# EAGLE design ODU Display 0603 (EAGLE 9.6.2)
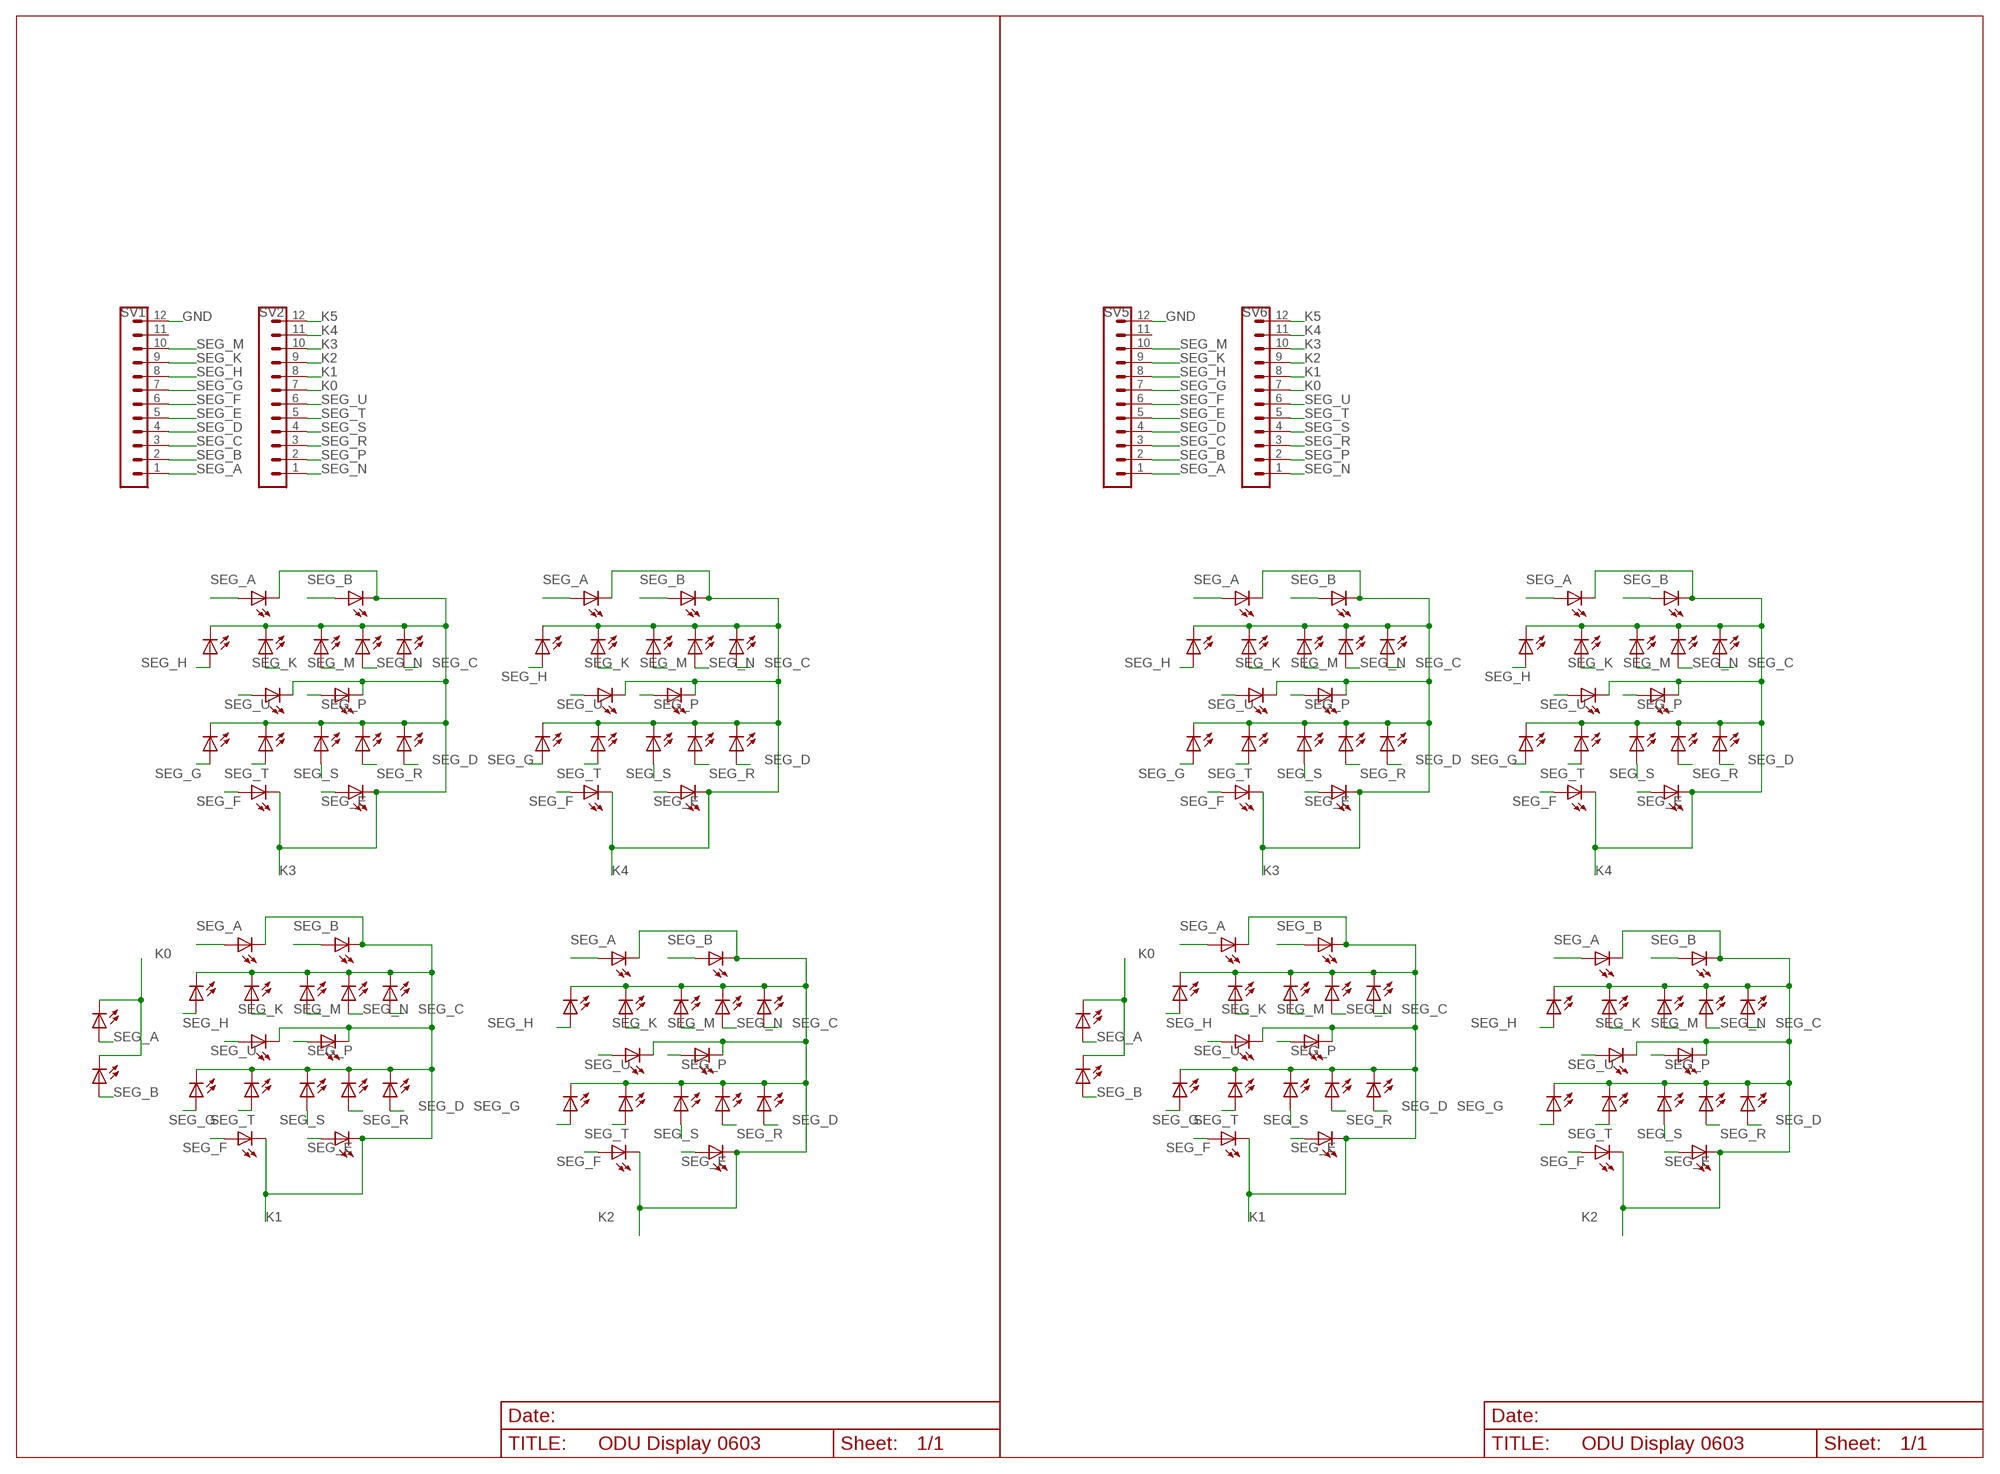
[diagram p0: schematic, sheet 1]

## Parts
LED_A1  LEDSMT0603_1  [CHIPLED_0603]
LED_A2  LEDSMT0603_1  [CHIPLED_0603]
LED_A3  LEDSMT0603_1  [CHIPLED_0603]
LED_A4  LEDSMT0603_1  [CHIPLED_0603]
LED_A9  LEDSMT0603_1  [CHIPLED_0603]
LED_A10  LEDSMT0603_1  [CHIPLED_0603]
LED_A11  LEDSMT0603_1  [CHIPLED_0603]
LED_A12  LEDSMT0603_1  [CHIPLED_0603]
LED_B1  LEDSMT0603_1  [CHIPLED_0603]
LED_B2  LEDSMT0603_1  [CHIPLED_0603]
LED_B3  LEDSMT0603_1  [CHIPLED_0603]
LED_B4  LEDSMT0603_1  [CHIPLED_0603]
LED_B9  LEDSMT0603_1  [CHIPLED_0603]
LED_B10  LEDSMT0603_1  [CHIPLED_0603]
LED_B11  LEDSMT0603_1  [CHIPLED_0603]
LED_B12  LEDSMT0603_1  [CHIPLED_0603]
LED_C1  LEDSMT0603_1  [CHIPLED_0603]
LED_C2  LEDSMT0603_1  [CHIPLED_0603]
LED_C3  LEDSMT0603_1  [CHIPLED_0603]
LED_C4  LEDSMT0603_1  [CHIPLED_0603]
LED_C9  LEDSMT0603_1  [CHIPLED_0603]
LED_C10  LEDSMT0603_1  [CHIPLED_0603]
LED_C11  LEDSMT0603_1  [CHIPLED_0603]
LED_C12  LEDSMT0603_1  [CHIPLED_0603]
LED_D1  LEDSMT0603_1  [CHIPLED_0603]
LED_D2  LEDSMT0603_1  [CHIPLED_0603]
LED_D3  LEDSMT0603_1  [CHIPLED_0603]
LED_D4  LEDSMT0603_1  [CHIPLED_0603]
LED_D9  LEDSMT0603_1  [CHIPLED_0603]
LED_D10  LEDSMT0603_1  [CHIPLED_0603]
LED_D11  LEDSMT0603_1  [CHIPLED_0603]
LED_D12  LEDSMT0603_1  [CHIPLED_0603]
LED_E1  LEDSMT0603_1  [CHIPLED_0603]
LED_E2  LEDSMT0603_1  [CHIPLED_0603]
LED_E3  LEDSMT0603_1  [CHIPLED_0603]
LED_E4  LEDSMT0603_1  [CHIPLED_0603]
LED_E9  LEDSMT0603_1  [CHIPLED_0603]
LED_E10  LEDSMT0603_1  [CHIPLED_0603]
LED_E11  LEDSMT0603_1  [CHIPLED_0603]
LED_E12  LEDSMT0603_1  [CHIPLED_0603]
LED_F1  LEDSMT0603_1  [CHIPLED_0603]
LED_F2  LEDSMT0603_1  [CHIPLED_0603]
LED_F3  LEDSMT0603_1  [CHIPLED_0603]
LED_F4  LEDSMT0603_1  [CHIPLED_0603]
LED_F9  LEDSMT0603_1  [CHIPLED_0603]
LED_F10  LEDSMT0603_1  [CHIPLED_0603]
LED_F11  LEDSMT0603_1  [CHIPLED_0603]
LED_F12  LEDSMT0603_1  [CHIPLED_0603]
LED_G1  LEDSMT0603_1  [CHIPLED_0603]
LED_G2  LEDSMT0603_1  [CHIPLED_0603]
LED_G3  LEDSMT0603_1  [CHIPLED_0603]
LED_G4  LEDSMT0603_1  [CHIPLED_0603]
LED_G9  LEDSMT0603_1  [CHIPLED_0603]
LED_G10  LEDSMT0603_1  [CHIPLED_0603]
LED_G11  LEDSMT0603_1  [CHIPLED_0603]
LED_G12  LEDSMT0603_1  [CHIPLED_0603]
LED_H1  LEDSMT0603_1  [CHIPLED_0603]
LED_H2  LEDSMT0603_1  [CHIPLED_0603]
LED_H3  LEDSMT0603_1  [CHIPLED_0603]
LED_H4  LEDSMT0603_1  [CHIPLED_0603]
LED_H9  LEDSMT0603_1  [CHIPLED_0603]
LED_H10  LEDSMT0603_1  [CHIPLED_0603]
LED_H11  LEDSMT0603_1  [CHIPLED_0603]
LED_H12  LEDSMT0603_1  [CHIPLED_0603]
LED_K1  LEDSMT0603_1  [CHIPLED_0603]
LED_K2  LEDSMT0603_1  [CHIPLED_0603]
LED_K3  LEDSMT0603_1  [CHIPLED_0603]
LED_K4  LEDSMT0603_1  [CHIPLED_0603]
LED_K9  LEDSMT0603_1  [CHIPLED_0603]
LED_K10  LEDSMT0603_1  [CHIPLED_0603]
LED_K11  LEDSMT0603_1  [CHIPLED_0603]
LED_K12  LEDSMT0603_1  [CHIPLED_0603]
LED_M1  LEDSMT0603_1  [CHIPLED_0603]
LED_M2  LEDSMT0603_1  [CHIPLED_0603]
LED_M3  LEDSMT0603_1  [CHIPLED_0603]
LED_M4  LEDSMT0603_1  [CHIPLED_0603]
LED_M9  LEDSMT0603_1  [CHIPLED_0603]
LED_M10  LEDSMT0603_1  [CHIPLED_0603]
LED_M11  LEDSMT0603_1  [CHIPLED_0603]
LED_M12  LEDSMT0603_1  [CHIPLED_0603]
LED_N1  LEDSMT0603_1  [CHIPLED_0603]
LED_N2  LEDSMT0603_1  [CHIPLED_0603]
LED_N3  LEDSMT0603_1  [CHIPLED_0603]
LED_N4  LEDSMT0603_1  [CHIPLED_0603]
LED_N9  LEDSMT0603_1  [CHIPLED_0603]
LED_N10  LEDSMT0603_1  [CHIPLED_0603]
LED_N11  LEDSMT0603_1  [CHIPLED_0603]
LED_N12  LEDSMT0603_1  [CHIPLED_0603]
LED_P1  LEDSMT0603_1  [CHIPLED_0603]
LED_P2  LEDSMT0603_1  [CHIPLED_0603]
LED_P3  LEDSMT0603_1  [CHIPLED_0603]
LED_P4  LEDSMT0603_1  [CHIPLED_0603]
LED_P9  LEDSMT0603_1  [CHIPLED_0603]
LED_P10  LEDSMT0603_1  [CHIPLED_0603]
LED_P11  LEDSMT0603_1  [CHIPLED_0603]
LED_P12  LEDSMT0603_1  [CHIPLED_0603]
LED_R1  LEDSMT0603_1  [CHIPLED_0603]
LED_R2  LEDSMT0603_1  [CHIPLED_0603]
LED_R3  LEDSMT0603_1  [CHIPLED_0603]
LED_R4  LEDSMT0603_1  [CHIPLED_0603]
LED_R9  LEDSMT0603_1  [CHIPLED_0603]
LED_R10  LEDSMT0603_1  [CHIPLED_0603]
LED_R11  LEDSMT0603_1  [CHIPLED_0603]
LED_R12  LEDSMT0603_1  [CHIPLED_0603]
LED_S1  LEDSMT0603_1  [CHIPLED_0603]
LED_S2  LEDSMT0603_1  [CHIPLED_0603]
LED_S3  LEDSMT0603_1  [CHIPLED_0603]
LED_S4  LEDSMT0603_1  [CHIPLED_0603]
LED_S9  LEDSMT0603_1  [CHIPLED_0603]
LED_S10  LEDSMT0603_1  [CHIPLED_0603]
LED_S11  LEDSMT0603_1  [CHIPLED_0603]
LED_S12  LEDSMT0603_1  [CHIPLED_0603]
LED_SEL1  LEDSMT0603_1  [CHIPLED_0603]
LED_SEL2  LEDSMT0603_1  [CHIPLED_0603]
LED_SEL5  LEDSMT0603_1  [CHIPLED_0603]
LED_SEL6  LEDSMT0603_1  [CHIPLED_0603]
LED_T1  LEDSMT0603_1  [CHIPLED_0603]
LED_T2  LEDSMT0603_1  [CHIPLED_0603]
LED_T3  LEDSMT0603_1  [CHIPLED_0603]
LED_T4  LEDSMT0603_1  [CHIPLED_0603]
LED_T9  LEDSMT0603_1  [CHIPLED_0603]
LED_T10  LEDSMT0603_1  [CHIPLED_0603]
LED_T11  LEDSMT0603_1  [CHIPLED_0603]
LED_T12  LEDSMT0603_1  [CHIPLED_0603]
LED_U1  LEDSMT0603_1  [CHIPLED_0603]
LED_U2  LEDSMT0603_1  [CHIPLED_0603]
LED_U3  LEDSMT0603_1  [CHIPLED_0603]
LED_U4  LEDSMT0603_1  [CHIPLED_0603]
LED_U9  LEDSMT0603_1  [CHIPLED_0603]
LED_U10  LEDSMT0603_1  [CHIPLED_0603]
LED_U11  LEDSMT0603_1  [CHIPLED_0603]
LED_U12  LEDSMT0603_1  [CHIPLED_0603]
SV1  MA12-1  [MA12-1]
SV2  MA12-1  [MA12-1]
SV5  MA12-1  [MA12-1]
SV6  MA12-1  [MA12-1]

## Nets
GND: SV1.12 SV5.12
K0: LED_SEL1.C LED_SEL2.C LED_SEL5.C LED_SEL6.C SV2.7 SV6.7
K1: LED_A1.C LED_A9.C LED_B1.C LED_B9.C LED_C1.C LED_C9.C LED_D1.C LED_D9.C LED_E1.C LED_E9.C LED_F1.C LED_F9.C LED_G1.C LED_G9.C LED_H1.C LED_H9.C LED_K1.C LED_K9.C LED_M1.C LED_M9.C LED_N1.C LED_N9.C LED_P1.C LED_P9.C LED_R1.C LED_R9.C LED_S1.C LED_S9.C LED_T1.C LED_T9.C LED_U1.C LED_U9.C SV2.8 SV6.8
K2: LED_A2.C LED_A10.C LED_B2.C LED_B10.C LED_C2.C LED_C10.C LED_D2.C LED_D10.C LED_E2.C LED_E10.C LED_F2.C LED_F10.C LED_G2.C LED_G10.C LED_H2.C LED_H10.C LED_K2.C LED_K10.C LED_M2.C LED_M10.C LED_N2.C LED_N10.C LED_P2.C LED_P10.C LED_R2.C LED_R10.C LED_S2.C LED_S10.C LED_T2.C LED_T10.C LED_U2.C LED_U10.C SV2.9 SV6.9
K3: LED_A3.C LED_A11.C LED_B3.C LED_B11.C LED_C3.C LED_C11.C LED_D3.C LED_D11.C LED_E3.C LED_E11.C LED_F3.C LED_F11.C LED_G3.C LED_G11.C LED_H3.C LED_H11.C LED_K3.C LED_K11.C LED_M3.C LED_M11.C LED_N3.C LED_N11.C LED_P3.C LED_P11.C LED_R3.C LED_R11.C LED_S3.C LED_S11.C LED_T3.C LED_T11.C LED_U3.C LED_U11.C SV2.10 SV6.10
K4: LED_A4.C LED_A12.C LED_B4.C LED_B12.C LED_C4.C LED_C12.C LED_D4.C LED_D12.C LED_E4.C LED_E12.C LED_F4.C LED_F12.C LED_G4.C LED_G12.C LED_H4.C LED_H12.C LED_K4.C LED_K12.C LED_M4.C LED_M12.C LED_N4.C LED_N12.C LED_P4.C LED_P12.C LED_R4.C LED_R12.C LED_S4.C LED_S12.C LED_T4.C LED_T12.C LED_U4.C LED_U12.C SV2.11 SV6.11
K5: SV2.12 SV6.12
SEG_A: LED_A1.A LED_A2.A LED_A3.A LED_A4.A LED_A9.A LED_A10.A LED_A11.A LED_A12.A LED_SEL1.A LED_SEL5.A SV1.1 SV5.1
SEG_B: LED_B1.A LED_B2.A LED_B3.A LED_B4.A LED_B9.A LED_B10.A LED_B11.A LED_B12.A LED_SEL2.A LED_SEL6.A SV1.2 SV5.2
SEG_C: LED_C1.A LED_C2.A LED_C3.A LED_C4.A LED_C9.A LED_C10.A LED_C11.A LED_C12.A SV1.3 SV5.3
SEG_D: LED_D1.A LED_D2.A LED_D3.A LED_D4.A LED_D9.A LED_D10.A LED_D11.A LED_D12.A SV1.4 SV5.4
SEG_E: LED_E1.A LED_E2.A LED_E3.A LED_E4.A LED_E9.A LED_E10.A LED_E11.A LED_E12.A SV1.5 SV5.5
SEG_F: LED_F1.A LED_F2.A LED_F3.A LED_F4.A LED_F9.A LED_F10.A LED_F11.A LED_F12.A SV1.6 SV5.6
SEG_G: LED_G1.A LED_G2.A LED_G3.A LED_G4.A LED_G9.A LED_G10.A LED_G11.A LED_G12.A SV1.7 SV5.7
SEG_H: LED_H1.A LED_H2.A LED_H3.A LED_H4.A LED_H9.A LED_H10.A LED_H11.A LED_H12.A SV1.8 SV5.8
SEG_K: LED_K1.A LED_K2.A LED_K3.A LED_K4.A LED_K9.A LED_K10.A LED_K11.A LED_K12.A SV1.9 SV5.9
SEG_M: LED_M1.A LED_M2.A LED_M3.A LED_M4.A LED_M9.A LED_M10.A LED_M11.A LED_M12.A SV1.10 SV5.10
SEG_N: LED_N1.A LED_N2.A LED_N3.A LED_N4.A LED_N9.A LED_N10.A LED_N11.A LED_N12.A SV2.1 SV6.1
SEG_P: LED_P1.A LED_P2.A LED_P3.A LED_P4.A LED_P9.A LED_P10.A LED_P11.A LED_P12.A SV2.2 SV6.2
SEG_R: LED_R1.A LED_R2.A LED_R3.A LED_R4.A LED_R9.A LED_R10.A LED_R11.A LED_R12.A SV2.3 SV6.3
SEG_S: LED_S1.A LED_S2.A LED_S3.A LED_S4.A LED_S9.A LED_S10.A LED_S11.A LED_S12.A SV2.4 SV6.4
SEG_T: LED_T1.A LED_T2.A LED_T3.A LED_T4.A LED_T9.A LED_T10.A LED_T11.A LED_T12.A SV2.5 SV6.5
SEG_U: LED_U1.A LED_U2.A LED_U3.A LED_U4.A LED_U9.A LED_U10.A LED_U11.A LED_U12.A SV2.6 SV6.6
Unconnected: SV1.11 SV5.11

## Library data of the parts
LED_A1-LED_A4 LED_A9-LED_A12 LED_B1-LED_B4 LED_B9-LED_B12 LED_C1-LED_C4 LED_C9-LED_C12 LED_D1-LED_D4 LED_D9-LED_D12 LED_E1-LED_E4 LED_E9-LED_E12 LED_F1-LED_F4 LED_F9-LED_F12 LED_G1-LED_G4 LED_G9-LED_G12 LED_H1-LED_H4 LED_H9-LED_H12 LED_K1-LED_K4 LED_K9-LED_K12 LED_M1-LED_M4 LED_M9-LED_M12 LED_N1-LED_N4 LED_N9-LED_N12 LED_P1-LED_P4 LED_P9-LED_P12 LED_R1-LED_R4 LED_R9-LED_R12 LED_S1-LED_S4 LED_S9-LED_S12 LED_SEL1 LED_SEL2 LED_SEL5 LED_SEL6 LED_T1-LED_T4 LED_T9-LED_T12 LED_U1-LED_U4 LED_U9-LED_U12 = 000_nl2:LED: LED KINGBRIGHT: KPTL-3216 are the reverse LEDs Source: www.kingbright.com
SV1 SV2 SV5 SV6 = 000_nl2:MA12-1: PIN HEADER; OC_FARNELL: unknown; OC_NEWARK: unknown

## Board
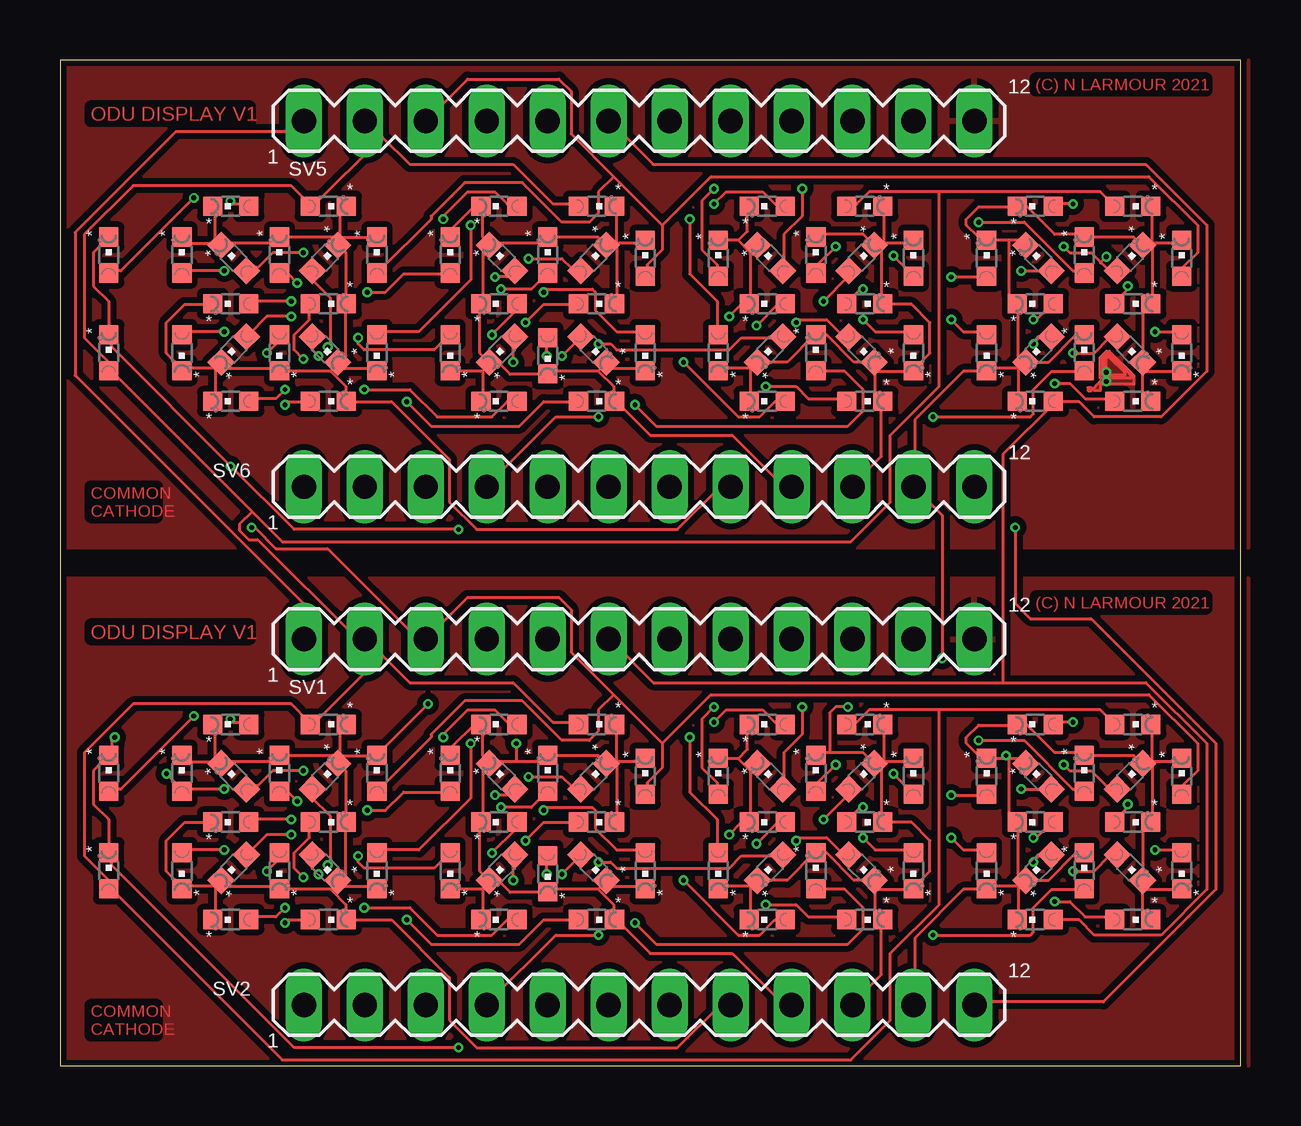
[diagram p1: board, top side]
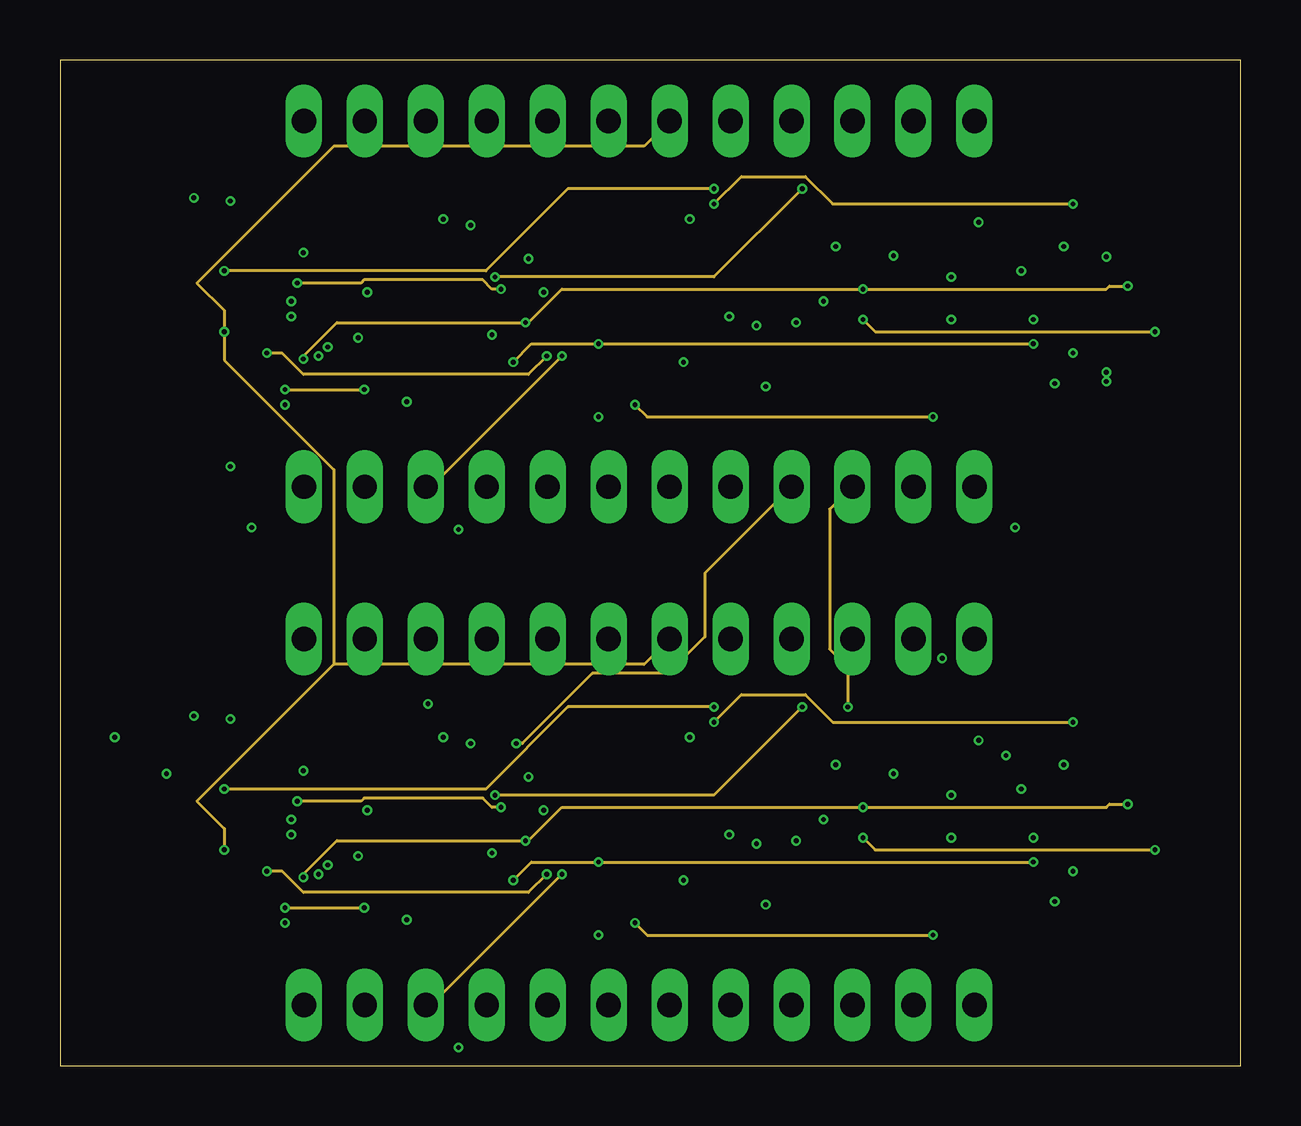
[diagram p2: board, inner layer Route2]
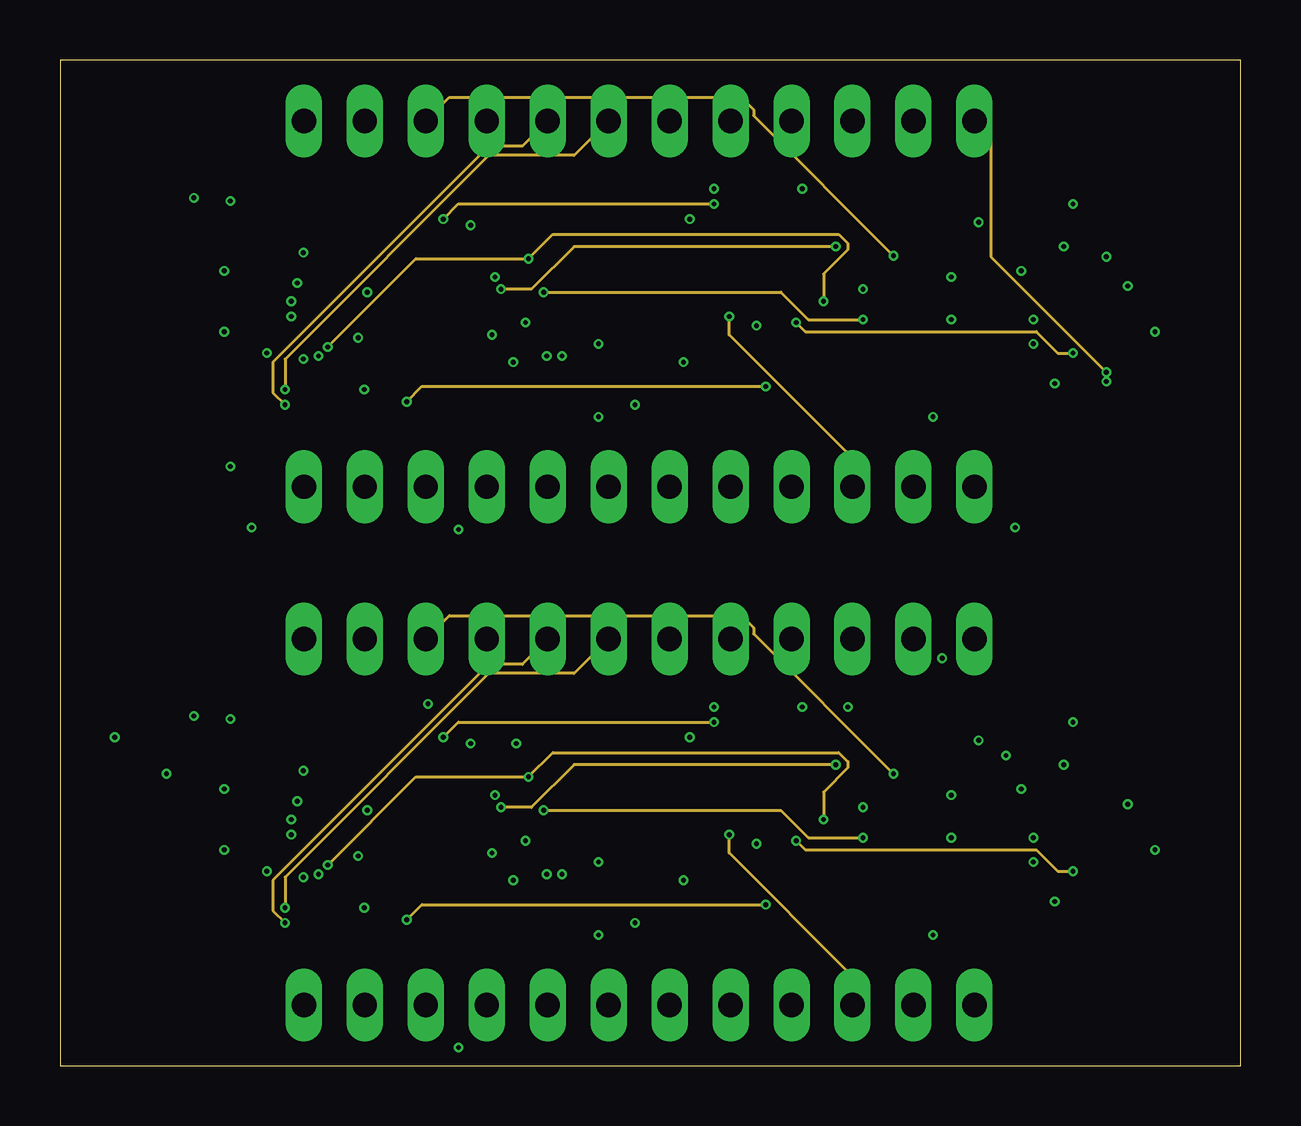
[diagram p3: board, inner layer Route15]
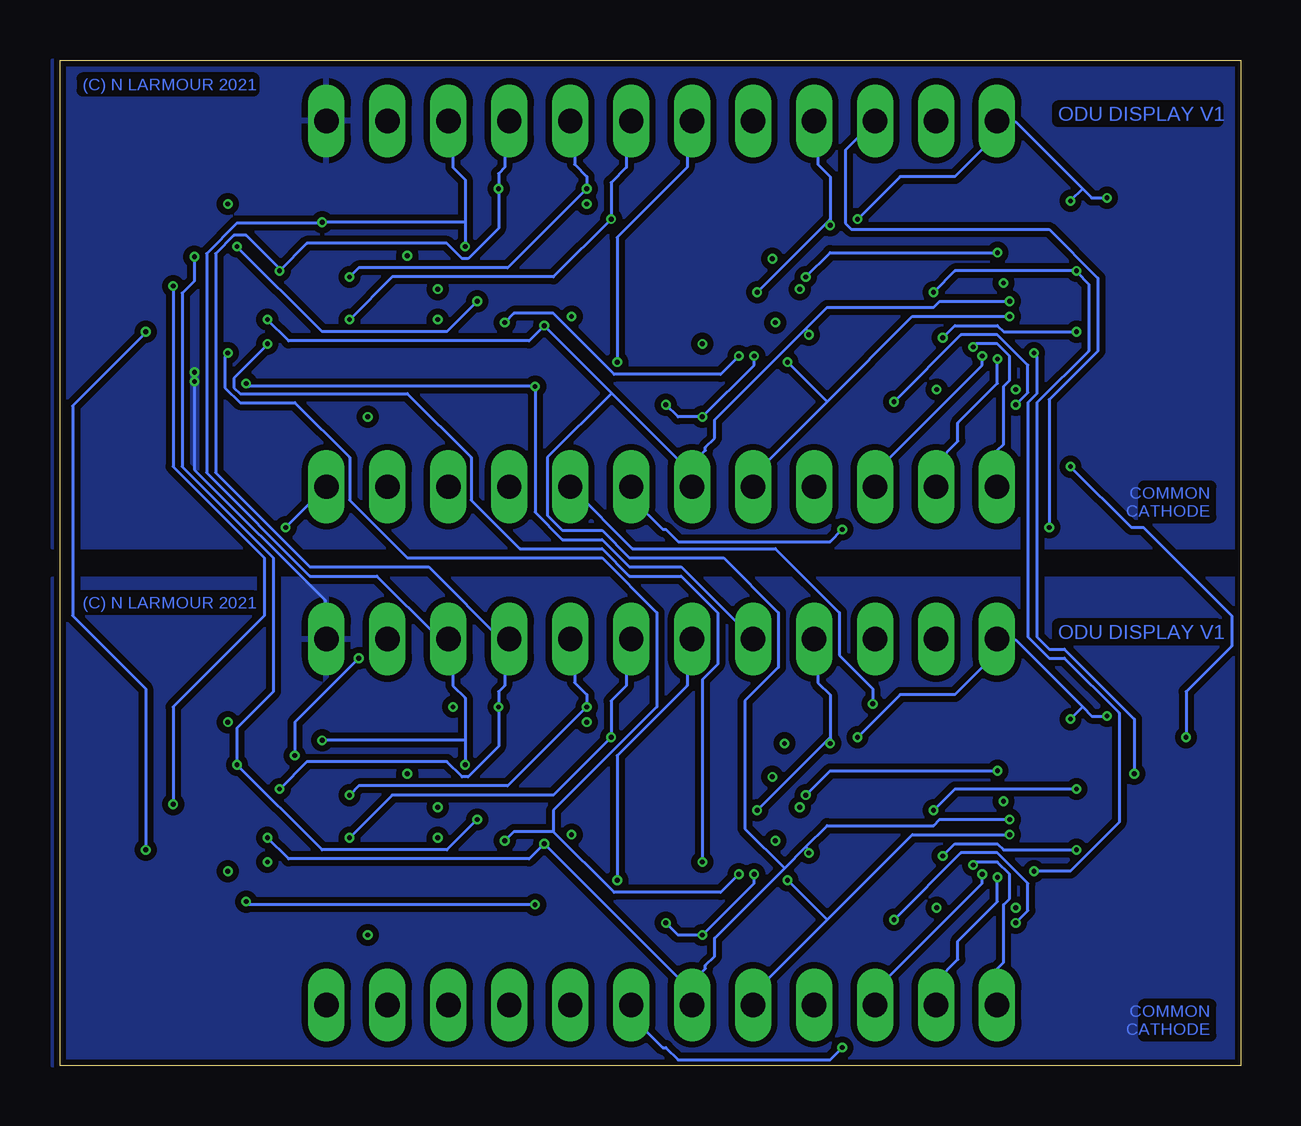
[diagram p4: board, bottom side, seen from below]

Size 49.2 x 41.91 mm. Coordinates in mm from the lower left corner, seen from the top.
Outline: 0,0 49.2,0 49.2,41.91 0,41.91 0,0
Copper layers (1*2*15*16): Top 0.035559375mm / dielectric 0.17018125mm / Route2 0.01778125mm / dielectric 47mil / Route15 0.01778125mm / dielectric 0.17018125mm / Bottom 0.035559375mm
Design rules "jlcpcb-4-layer": minimum track width 5mil, minimum drill 0.2mm, track to track 0.126490625mm, track to pad 0.126490625mm, pad to pad 0.126490625mm, via to via 0.126490625mm, smd to smd 0mil, copper to edge 0.1mm, drill to drill 5mil, minimum pad ring 4mil, minimum via ring 4mil, stop-mask expansion 3mil, vias tented up to drill 100mil, thermal gap 10mil

### Footprints (pad centres in the part's own frame; a part is rotated, then mirrored left to right if it is on the bottom)
CHIPLED_0603 = smd 0.8 x 0.8: A 0,-0.75; C 0,0.75
MA12-1 = drill 1.016 long: 1 -13.97,0; 2 -11.43,0; 3 -8.89,0; 4 -6.35,0; 5 -3.81,0; 6 -1.27,0; 7 1.27,0; 8 3.81,0; 9 6.35,0; 10 8.89,0; 11 11.43,0; 12 13.97,0

### Placement (x,y rotation side)
LED_A1  7.11,14.22 90 top
LED_A2  18.29,14.22 90 top
LED_A3  29.46,14.22 90 top
LED_A4  40.64,14.22 90 top
LED_A9  7.11,35.81 90 top
LED_A10  18.29,35.81 90 top
LED_A11  29.46,35.81 90 top
LED_A12  40.64,35.81 90 top
LED_B1  11.18,14.22 270 top
LED_B2  22.35,14.22 270 top
LED_B3  33.53,14.22 270 top
LED_B4  44.7,14.22 270 top
LED_B9  11.18,35.81 270 top
LED_B10  22.35,35.81 270 top
LED_B11  33.53,35.81 270 top
LED_B12  44.7,35.81 270 top
LED_C1  13.21,12.19 0 top
LED_C2  24.38,12.06 0 top
LED_C3  35.56,12.06 0 top
LED_C4  46.74,12.06 0 top
LED_C9  13.21,33.78 0 top
LED_C10  24.38,33.66 0 top
LED_C11  35.56,33.66 0 top
LED_C12  46.74,33.66 0 top
LED_D1  13.21,8.13 180 top
LED_D2  24.38,8.13 180 top
LED_D3  35.56,8.13 180 top
LED_D4  46.74,8.13 180 top
LED_D9  13.21,29.72 180 top
LED_D10  24.38,29.72 180 top
LED_D11  35.56,29.72 180 top
LED_D12  46.74,29.72 180 top
LED_E1  11.18,6.1 270 top
LED_E2  22.35,6.1 270 top
LED_E3  33.53,6.1 270 top
LED_E4  44.7,6.1 270 top
LED_E9  11.18,27.69 270 top
LED_E10  22.35,27.69 270 top
LED_E11  33.53,27.69 270 top
LED_E12  44.7,27.69 270 top
LED_F1  7.11,6.1 90 top
LED_F2  18.29,6.1 90 top
LED_F3  29.46,6.1 90 top
LED_F4  40.64,6.1 90 top
LED_F9  7.11,27.69 90 top
LED_F10  18.29,27.69 90 top
LED_F11  29.46,27.69 90 top
LED_F12  40.64,27.69 90 top
LED_G1  5.08,8.13 180 top
LED_G2  16.26,8.13 180 top
LED_G3  27.43,8.13 180 top
LED_G4  38.61,8.13 180 top
LED_G9  5.08,29.72 180 top
LED_G10  16.26,29.72 180 top
LED_G11  27.43,29.72 180 top
LED_G12  38.61,29.72 180 top
LED_H1  5.08,12.19 0 top
LED_H2  16.26,12.19 0 top
LED_H3  27.43,12.06 0 top
LED_H4  38.61,12.06 0 top
LED_H9  5.08,33.78 0 top
LED_H10  16.26,33.78 0 top
LED_H11  27.43,33.66 0 top
LED_H12  38.61,33.66 0 top
LED_K1  7.24,12.06 45 top
LED_K2  18.41,12.06 45 top
LED_K3  29.59,12.06 45 top
LED_K4  40.77,12.06 45 top
LED_K9  7.24,33.66 45 top
LED_K10  18.41,33.66 45 top
LED_K11  29.59,33.66 45 top
LED_K12  40.77,33.66 45 top
LED_M1  9.14,12.19 0 top
LED_M2  20.32,12.19 0 top
LED_M3  31.5,12.19 0 top
LED_M4  42.67,12.19 0 top
LED_M9  9.14,33.78 0 top
LED_M10  20.32,33.78 0 top
LED_M11  31.5,33.78 0 top
LED_M12  42.67,33.78 0 top
LED_N1  11.05,12.06 315 top
LED_N2  22.23,12.06 315 top
LED_N3  33.4,12.06 315 top
LED_N4  44.58,12.06 315 top
LED_N9  11.05,33.66 315 top
LED_N10  22.23,33.66 315 top
LED_N11  33.4,33.66 315 top
LED_N12  44.58,33.66 315 top
LED_P1  11.18,10.16 270 top
LED_P2  22.35,10.16 270 top
LED_P3  33.53,10.16 270 top
LED_P4  44.7,10.16 270 top
LED_P9  11.18,31.75 270 top
LED_P10  22.35,31.75 270 top
LED_P11  33.53,31.75 270 top
LED_P12  44.7,31.75 270 top
LED_R1  11.05,8.26 225 top
LED_R2  22.23,8.26 225 top
LED_R3  33.4,8.26 225 top
LED_R4  44.58,8.26 225 top
LED_R9  11.05,29.84 225 top
LED_R10  22.23,29.84 225 top
LED_R11  33.4,29.84 225 top
LED_R12  44.58,29.84 225 top
LED_S1  9.14,8.13 180 top
LED_S2  20.32,8 180 top
LED_S3  31.5,8.13 0 top
LED_S4  42.67,8.13 0 top
LED_S9  9.14,29.72 180 top
LED_S10  20.32,29.59 180 top
LED_S11  31.5,29.72 0 top
LED_S12  42.67,29.72 0 top
LED_SEL1  2.03,12.19 0 top
LED_SEL2  2.03,8.13 0 top
LED_SEL5  2.03,33.78 0 top
LED_SEL6  2.03,29.72 0 top
LED_T1  7.24,8.26 135 top
LED_T2  18.41,8.26 135 top
LED_T3  29.59,8.26 135 top
LED_T4  40.77,8.26 135 top
LED_T9  7.24,29.84 135 top
LED_T10  18.41,29.84 135 top
LED_T11  29.59,29.84 135 top
LED_T12  40.77,29.84 135 top
LED_U1  7.11,10.16 90 top
LED_U2  18.29,10.16 90 top
LED_U3  29.46,10.16 90 top
LED_U4  40.64,10.16 90 top
LED_U9  7.11,31.75 90 top
LED_U10  18.29,31.75 90 top
LED_U11  29.46,31.75 90 top
LED_U12  40.64,31.75 90 top
SV1  24.13,17.78 0 top
SV2  24.13,2.54 0 top
SV5  24.13,39.37 0 top
SV6  24.13,24.13 0 top

### Tracks (layer width: path | path; a pad name or v marks a point on that pad's centre or on a via)
GND  (via drill 0.2)
  Top 0.127: v43.6,28.52 43.35,28.52 42.97,28.14 42.84,28.14 42.84,28.26 42.97,28.26 43.09,28.14 43.35,28.14 43.35,28.39 44.74,28.39 44.74,28.77 43.73,29.79 43.6,29.79 43.35,29.53 43.35,28.64 44.61,28.64 44.61,28.77 43.73,29.66 43.6,29.66 43.47,29.53 43.47,28.77 44.36,28.77 44.36,28.9 43.73,29.53 43.6,29.53 v43.6,28.9
  Route15 0.127: v43.6,28.9 38.78,33.71 38.78,38.66 38.15,39.29 SV5.12
  Bottom 0.127: v43.6,28.52 43.6,24.84 38.15,19.39 38.15,17.87 SV1.12
  pour Top (isolate 0.254): 0,20.32 49.53,20.32 49.53,0 0,0
  pour Bottom (isolate 0.254): 0,20.32 49.53,20.32 49.53,0 0,0
  pour Top (isolate 0.254): 0,20.32 49.53,20.32 49.53,0 0,0
  pour Top (isolate 0.254): 0,41.91 49.53,41.91 49.53,21.59 0,21.59
  pour Bottom (isolate 0.254): 0,41.91 49.53,41.91 49.53,21.59 0,21.59
  pour Top (isolate 0.254): 0,41.91 49.53,41.91 49.53,21.59 0,21.59
K0  (via drill 0.2)
  Top 0.127: v16.6,0.76 9.76,0.76 2.15,8.37 2.15,8.87 LED_SEL2.C 2.03,9 2.03,10.27 1.39,10.9 1.39,12.29 2.03,12.93 LED_SEL1.C 2.15,13.05 2.15,13.56 v2.28,13.69 | LED_SEL5.C 2.03,34.52 1.39,33.88 1.39,32.49 2.03,31.86 2.03,30.59 LED_SEL6.C 2.15,30.46 2.15,29.95 7.12,24.99 | 7.12,24.99 9.76,22.35 v16.6,22.35 | v7.1,24.97 7.12,24.99
  Bottom 0.127: v16.6,0.76 17.11,0.25 23.45,0.25 23.95,0.76 24.08,0.76 25.35,2.03 25.35,2.54 SV2.7 | v16.6,22.35 17.11,21.84 23.45,21.84 23.95,22.35 24.08,22.35 25.35,23.62 25.35,24.12 SV6.7 | v2.28,13.69 2.28,15.59 0.38,17.49 0.38,18.76 4.06,22.43 4.56,22.43 v7.1,24.97
K1  (via drill 0.2)
  Top 0.127: 6.46,12.67 5.45,12.67 5.2,12.93 LED_H1.C | 6.46,12.67 6.59,12.67 LED_K1.C | 6.46,12.67 6.46,14.2 LED_A1.C | 6.46,12.67 LED_K1.C | 11.66,12.93 11.66,13.94 11.91,14.2 LED_B1.C | 11.66,12.93 11.66,12.67 LED_N1.C | LED_N1.C 11.66,12.55 11.91,12.29 11.91,10.27 LED_P1.C 11.91,10.14 11.91,7.99 11.66,7.73 LED_R1.C | 11.66,12.93 9.25,12.93 LED_M1.C 9.13,12.93 8.87,12.67 6.72,12.67 LED_K1.C | 11.66,12.93 13.18,12.93 LED_C1.C 13.31,13.05 v15.34,15.08 | 11.66,12.93 LED_N1.C | 11.28,7.35 9.25,7.35 LED_S1.C 9.13,7.48 6.84,7.48 6.72,7.61 LED_T1.C | 11.28,7.35 11.53,7.61 LED_R1.C | 11.28,7.35 11.91,6.72 11.91,6.21 LED_E1.C 12.04,6.08 13.81,6.08 16.22,3.68 16.22,1.9 17.36,0.76 25.73,0.76 27.5,2.54 27.88,2.54 SV2.8 | LED_D1.C 13.18,7.48 11.79,7.48 11.66,7.61 LED_R1.C | 6.46,7.48 5.2,7.48 LED_G1.C 5.07,7.48 4.44,8.11 4.44,9.38 5.2,10.14 6.34,10.14 LED_U1.C | 6.46,7.48 6.59,7.61 LED_T1.C | 6.46,7.48 6.46,6.21 LED_F1.C | 6.46,7.48 LED_T1.C | 6.46,34.26 5.45,34.26 5.2,34.52 LED_H9.C | 6.46,34.26 6.59,34.26 LED_K9.C | 6.46,34.26 6.46,35.78 LED_A9.C | 6.46,34.26 LED_K9.C | 11.66,34.52 11.66,35.53 11.91,35.78 LED_B9.C | 11.66,34.52 11.66,34.26 LED_N9.C | LED_N9.C 11.66,34.14 11.91,33.88 11.91,31.86 LED_P9.C 11.91,31.73 11.91,29.57 11.66,29.32 LED_R9.C | 11.66,34.52 9.25,34.52 LED_M9.C 9.13,34.52 8.87,34.26 6.72,34.26 LED_K9.C | 11.66,34.52 13.18,34.52 LED_C9.C | 11.66,34.52 LED_N9.C | 11.28,28.94 9.25,28.94 LED_S9.C 9.13,29.07 6.84,29.07 6.72,29.2 LED_T9.C | 11.28,28.94 11.53,29.2 LED_R9.C | 11.28,28.94 11.91,28.31 11.91,27.8 LED_E9.C 12.04,27.67 13.81,27.67 16.22,25.27 16.22,23.49 17.36,22.35 25.73,22.35 27.5,24.12 27.88,24.12 SV6.8
  Top 0.127: LED_D9.C 13.18,29.07 11.79,29.07 11.66,29.2 LED_R9.C | 6.46,29.07 5.2,29.07 LED_G9.C 5.07,29.07 4.44,29.7 4.44,30.97 5.2,31.73 6.34,31.73 LED_U9.C | 6.46,29.07 6.59,29.2 LED_T9.C | 6.46,29.07 6.46,27.8 LED_F9.C | 6.46,29.07 LED_T9.C
  Bottom 0.127: v15.34,15.08 15.34,15.72 16.73,17.11 16.73,18.89 19.39,21.55 25.35,21.55 27.88,24.08 SV6.8
K2  (via drill 0.2)
  Top 0.127: LED_H2.C 16.35,13.05 16.35,13.31 17.24,14.2 17.49,14.2 LED_A2.C 17.62,14.2 17.62,12.93 17.87,12.67 LED_K2.C | LED_K2.C 17.87,12.55 17.62,12.29 17.62,10.27 LED_U2.C 17.49,10.14 17.49,8.11 LED_T2.C | 23.19,12.67 24.21,12.67 24.34,12.8 LED_C2.C | 23.19,12.67 22.81,12.67 LED_N2.C | 23.19,12.67 23.19,10.27 LED_P2.C | LED_N2.C 22.69,12.67 22.43,12.93 20.41,12.93 LED_M2.C 20.28,12.93 20.03,12.67 19.01,12.67 | 23.19,12.67 23.19,14.2 LED_B2.C | 23.19,12.67 LED_N2.C | 19.01,12.67 18,12.67 LED_K2.C | 17.62,7.35 17.62,6.21 LED_F2.C | 17.62,7.35 17.87,7.61 LED_T2.C | 17.62,7.35 16.35,7.35 LED_G2.C | 22.43,7.35 20.41,7.35 LED_S2.C 20.28,7.22 18.76,7.22 18.38,7.61 18,7.61 LED_T2.C | 22.43,7.35 22.69,7.61 LED_R2.C 22.81,7.61 22.94,7.48 24.34,7.48 LED_D2.C | 22.43,7.35 23.07,6.72 23.07,6.21 LED_E2.C 23.19,6.08 24.59,4.69 28.01,4.69 30.04,2.66 30.42,2.66 SV2.9 | LED_H10.C 16.35,34.65 16.35,34.9 17.24,35.78 17.49,35.78 LED_A10.C 17.62,35.78 17.62,34.52 17.87,34.26 LED_K10.C | LED_K10.C 17.87,34.14 17.62,33.88 17.62,31.86 LED_U10.C 17.49,31.73 17.49,29.7 17.87,29.32 LED_T10.C | 23.19,34.26 24.21,34.26 24.34,34.39 LED_C10.C | 23.19,34.26 22.81,34.26 LED_N10.C | 23.19,34.26 23.19,31.86 LED_P10.C | LED_N10.C 22.69,34.26 22.43,34.52 20.41,34.52 LED_M10.C 20.28,34.52 20.03,34.26 18,34.26 LED_K10.C | 23.19,34.26 23.19,35.78 LED_B10.C | 23.19,34.26 LED_N10.C | 17.62,28.94 17.62,27.8 LED_F10.C | 17.62,28.94 17.87,29.2 LED_T10.C | 17.62,28.94 16.35,28.94 LED_G10.C | 22.43,28.94 20.41,28.94 LED_S10.C 20.28,28.81 18.76,28.81 18.38,29.2 18,29.2 LED_T10.C | 22.43,28.94 22.69,29.2 LED_R10.C 22.81,29.2 22.94,29.07 24.34,29.07 LED_D10.C
  Top 0.127: 22.43,28.94 23.07,28.31 23.07,27.8 LED_E10.C 23.19,27.67 24.59,26.28 28.01,26.28 30.04,24.25 30.42,24.25 SV6.9 | v19.01,13.44 19.01,12.67
  Route2 0.127: v19.01,13.44 19.27,13.44 22.18,16.35 25.35,16.35 26.87,17.87 26.87,20.53 30.42,24.08 SV6.9
K3  (via drill 0.2)
  Top 0.127: 34.35,12.67 35.36,12.67 35.49,12.8 LED_C3.C | 34.35,12.67 34.22,12.67 | 34.22,12.67 33.97,12.67 LED_N3.C | 34.22,12.67 34.22,10.27 LED_P3.C 34.35,10.14 35.49,10.14 36.25,9.38 36.25,8.11 35.62,7.48 LED_D3.C 35.49,7.35 33.97,7.35 | 34.22,12.67 LED_N3.C | 32.07,13.05 33.46,13.05 33.84,12.67 LED_N3.C | 32.07,13.05 31.56,13.05 LED_M3.C | 34.35,12.67 34.35,14.2 LED_B3.C | 34.35,12.67 LED_N3.C | 28.77,7.48 28.9,7.48 29.02,7.61 LED_T3.C | 28.77,7.48 27.5,7.48 LED_G3.C | 28.77,7.48 28.77,6.21 LED_F3.C | 28.77,7.48 LED_T3.C | 33.97,7.35 33.97,6.46 34.22,6.21 LED_E3.C 34.22,6.08 34.22,3.8 33.08,2.66 SV2.10 | 33.97,7.35 33.97,7.61 LED_R3.C | 33.97,7.35 LED_R3.C | LED_R3.C 33.84,7.73 33.08,7.73 31.94,8.87 31.56,8.87 LED_S3.C 31.43,8.87 30.29,7.73 29.15,7.73 LED_T3.C | 28.77,12.29 28.77,10.27 LED_U3.C 28.64,10.14 28.39,10.14 v27.88,9.63 | 28.77,12.29 29.02,12.55 LED_K3.C | 28.26,12.8 27.5,12.8 LED_H3.C | 28.77,12.29 28.26,12.8 | 28.26,12.8 28.64,13.18 28.64,14.2 LED_A3.C | 34.35,34.26 35.36,34.26 35.49,34.39 LED_C11.C | 34.35,34.26 34.22,34.26 | 34.22,34.26 33.97,34.26 LED_N11.C | 34.22,34.26 34.22,31.86 LED_P11.C 34.35,31.73 35.49,31.73 36.25,30.97 36.25,29.7 35.62,29.07 LED_D11.C 35.49,28.94 33.97,28.94 | 34.22,34.26 LED_N11.C | LED_M11.C 31.56,34.65 33.46,34.65 33.84,34.26 LED_N11.C | 34.35,34.26 34.35,35.78 LED_B11.C | 34.35,34.26 LED_N11.C | 28.77,29.07 28.9,29.07 29.02,29.2 LED_T11.C | 28.77,29.07 27.5,29.07 LED_G11.C | 28.77,29.07 28.77,27.8 LED_F11.C | 28.77,29.07 LED_T11.C | 33.97,28.94 33.97,28.05 34.22,27.8 LED_E11.C 34.22,27.67 34.22,25.39 33.08,24.25 SV6.10 | 33.97,28.94 33.97,29.2 LED_R11.C
  Top 0.127: 33.97,28.94 LED_R11.C | LED_R11.C 33.84,29.32 33.08,29.32 31.94,30.46 31.56,30.46 LED_S11.C 31.43,30.46 30.29,29.32 29.15,29.32 LED_T11.C | 28.77,33.88 28.77,31.86 LED_U11.C 28.64,31.73 28.39,31.73 v27.88,31.22 | 28.77,33.88 29.02,34.14 LED_K11.C | 28.26,34.39 27.5,34.39 LED_H11.C | 28.77,33.88 28.26,34.39 | 28.26,34.39 28.64,34.77 28.64,35.78 LED_A11.C | 32.07,13.05 32.07,14.7 32.32,14.96 v32.83,14.96
  Route2 0.127: v32.83,14.96 32.83,16.6 32.07,17.36 32.07,23.19 32.95,24.08 SV6.10
  Route15 0.127: v27.88,9.63 27.88,8.87 32.95,3.8 32.95,2.66 SV2.10 | v27.88,31.22 27.88,30.46 32.95,25.39 32.95,24.25 SV6.10
K4  (via drill 0.2)
  Top 0.127: 45.12,7.35 45.12,6.46 45.37,6.21 LED_E4.C | 45.12,7.35 45.12,7.61 LED_R4.C | 45.12,7.35 46.64,7.35 LED_D4.C | 45.12,7.35 LED_R4.C | 45.5,12.67 46.52,12.67 46.64,12.8 LED_C4.C | 45.5,12.67 45.12,12.67 LED_N4.C | 45.5,12.67 45.5,10.27 LED_P4.C 45.37,10.14 45.12,9.89 45.12,7.73 LED_R4.C | LED_N4.C 44.99,12.67 44.74,12.93 42.71,12.93 LED_M4.C 42.59,13.05 41.45,13.05 40.3,14.2 39.92,14.2 LED_A4.C 39.8,14.2 38.28,14.2 37.77,13.69 37.77,13.44 38.28,12.93 38.53,12.93 LED_H4.C 38.66,12.8 39.42,12.8 | 45.5,12.67 45.5,14.2 LED_B4.C | 45.5,12.67 LED_N4.C | 39.54,12.8 40.05,12.8 40.18,12.67 LED_K4.C | 39.54,12.8 39.42,12.8 | 39.92,7.48 40.05,7.48 40.18,7.61 LED_T4.C | 39.92,7.48 38.66,7.48 LED_G4.C 38.53,7.35 37.64,7.35 35.62,5.32 35.62,2.66 SV2.11 | 39.92,7.48 39.92,6.21 LED_F4.C | 39.92,7.48 LED_T4.C | LED_T4.C 40.18,7.73 39.92,7.99 39.92,10.14 LED_U4.C 39.8,10.27 39.54,10.52 39.54,12.8 | LED_S4.C 42.59,8.87 42.33,8.87 41.19,7.73 40.3,7.73 LED_T4.C | 45.12,28.94 45.12,28.05 45.37,27.8 LED_E12.C | 45.12,28.94 45.12,29.2 LED_R12.C | 45.12,28.94 46.64,28.94 LED_D12.C | 45.12,28.94 LED_R12.C | 45.5,34.26 46.52,34.26 46.64,34.39 LED_C12.C | 45.5,34.26 45.12,34.26 LED_N12.C | 45.5,34.26 45.5,31.86 LED_P12.C 45.37,31.73 45.12,31.48 45.12,29.32 LED_R12.C | LED_N12.C 44.99,34.26 44.74,34.52 42.71,34.52 LED_M12.C 42.59,34.65 41.45,34.65 40.3,35.78 39.92,35.78 LED_A12.C 39.8,35.78 38.28,35.78 37.77,35.28 37.77,35.02 38.28,34.52 38.53,34.52 LED_H12.C 38.66,34.39 39.54,34.39 | 45.5,34.26 45.5,35.78 LED_B12.C | 45.5,34.26 LED_N12.C | 39.54,34.39 40.05,34.39 40.18,34.26 LED_K12.C | 39.92,29.07 40.05,29.07 40.18,29.2 LED_T12.C
  Top 0.127: 39.92,29.07 38.66,29.07 LED_G12.C 38.53,28.94 37.64,28.94 35.62,26.91 35.62,24.25 SV6.11 35.62,24.08 36.76,22.94 v36.76,16.98 | 39.92,29.07 39.92,27.8 LED_F12.C | 39.92,29.07 LED_T12.C | LED_T12.C 40.18,29.32 39.92,29.57 39.92,31.73 LED_U12.C 39.8,31.86 39.54,32.11 39.54,34.39 | LED_S12.C 42.59,30.46 42.33,30.46 41.19,29.32 40.3,29.32 LED_T12.C | v39.42,12.93 39.42,12.8
  Bottom 0.127: v39.42,12.93 39.42,14.32 v36.76,16.98
K5  (via drill 0.2)
  Top 0.127: v39.8,22.43 39.8,19.27 40.43,18.63 42.97,18.63 48.16,13.44 48.16,7.35 43.47,2.66 38.15,2.66 SV2.12
  Bottom 0.127: v39.8,22.43 38.15,24.08 SV6.12
SEG_A  (via drill 0.2)
  Top 0.127: v5.58,14.58 2.54,11.53 2.15,11.53 LED_SEL1.A | v7.1,14.45 7.22,14.32 7.86,14.32 LED_A1.A | v15.97,13.69 15.97,13.81 16.98,14.83 18.12,14.83 18.63,14.32 19.01,14.32 LED_A2.A | v27.25,14.32 27.76,14.83 29.28,14.83 29.79,14.32 30.16,14.32 LED_A3.A | v42.21,14.32 41.45,14.32 LED_A4.A | v5.58,36.17 2.54,33.12 2.15,33.12 LED_SEL5.A | v7.1,36.04 7.22,35.91 7.86,35.91 LED_A9.A | v15.97,35.28 15.97,35.41 16.98,36.42 18.12,36.42 18.63,35.91 19.01,35.91 LED_A10.A | v27.25,35.91 27.76,36.42 29.28,36.42 29.79,35.91 30.16,35.91 LED_A11.A | v42.21,35.91 41.45,35.91 LED_A12.A | SV1.1 10.14,17.87 10.14,19.27 0.63,28.77 0.63,34.73 4.82,38.91 9.76,38.91 10.14,39.29 SV5.1
  Route2 0.127: v42.21,14.32 32.19,14.32 31.05,15.46 28.39,15.46 v27.25,14.32 | v42.21,35.91 32.19,35.91 31.05,37.05 28.39,37.05 v27.25,35.91
  Route15 0.127: v27.25,14.32 16.6,14.32 v15.97,13.69 | v27.25,35.91 16.6,35.91 v15.97,35.28
  Bottom 0.127: v5.58,14.58 6.21,14.58 6.59,14.96 | 6.59,14.96 9.38,17.74 10.14,17.74 SV1.1 10.27,17.74 10.27,17.11 11.91,15.46 14.2,15.46 v15.97,13.69 | 6.59,14.96 v7.1,14.45 | v5.58,36.17 6.21,36.17 6.59,36.55 | 6.59,36.55 9.38,39.33 10.14,39.33 SV5.1 10.27,39.33 10.27,38.7 11.91,37.05 14.2,37.05 v15.97,35.28 | 6.59,36.55 v7.1,36.04
SEG_B
  Top 0.127: 13.44,17.11 12.8,17.74 SV1.2 | 13.44,17.11 14.58,15.97 18.89,15.97 20.53,14.32 21.55,14.32 LED_B2.A | 36.63,14.83 43.35,14.83 43.85,14.32 LED_B4.A | 36.63,14.83 33.71,14.83 33.21,14.32 32.83,14.32 LED_B3.A | 36.63,14.83 36.63,6.72 34.6,4.69 34.6,1.9 32.95,0.25 9.25,0.25 2.15,7.35 LED_SEL2.A 2.03,7.48 2.03,7.73 1.01,8.74 1.01,13.05 3.04,15.08 9.63,15.08 10.39,14.32 LED_B1.A 10.52,14.2 13.44,17.11 | 13.44,17.11 SV1.2 | 13.44,38.7 12.8,39.33 SV5.2 13.44,38.7 | 13.44,38.7 14.58,37.56 18.89,37.56 20.53,35.91 21.55,35.91 LED_B10.A | 36.63,36.42 43.35,36.42 43.85,35.91 LED_B12.A | 36.63,36.42 33.71,36.42 33.21,35.91 32.83,35.91 LED_B11.A | 36.63,36.42 36.63,28.31 34.6,26.28 34.6,23.49 32.95,21.84 9.25,21.84 8.01,23.09 | 8.01,23.09 2.15,28.94 LED_SEL6.A 2.03,29.07 2.03,29.32 1.01,30.34 1.01,34.65 3.04,36.67 9.63,36.67 10.39,35.91 LED_B9.A 10.52,35.78 13.44,38.7 | 8.01,23.09 7.48,22.56 7.48,22.31 7.86,21.93 8.24,21.93 12.29,17.87 12.67,17.87 SV1.2
SEG_C  (via drill 0.2)
  Top 0.127: 25.09,13.44 25.09,12.42 24.46,11.79 24.46,11.41 LED_C2.A | 23.07,15.46 21.29,17.24 21.29,19.01 20.79,19.52 16.98,19.52 15.34,17.87 SV1.3 15.21,17.87 14.83,17.87 11.15,21.55 9,21.55 8.11,22.43 v7.99,22.43 | 23.07,15.46 25.09,13.44 | v34.73,12.17 35.49,11.41 LED_C3.A | 25.09,13.44 27.12,15.46 45.37,15.46 47.4,13.44 47.4,12.29 46.77,11.66 46.77,11.41 LED_C4.A | 23.07,15.46 22.43,14.83 22.43,13.94 22.05,13.56 20.91,13.56 19.27,15.21 16.86,15.21 15.46,13.81 15.46,13.69 13.31,11.53 LED_C1.A | 25.09,35.02 25.09,34.01 24.46,33.38 24.46,33 LED_C10.A | 23.07,37.05 21.29,38.83 21.29,40.6 20.79,41.11 16.98,41.11 15.34,39.46 SV5.3 | 23.07,37.05 25.09,35.02 | v34.73,33.76 35.49,33 LED_C11.A | 25.09,35.02 27.12,37.05 45.37,37.05 47.4,35.02 47.4,33.88 46.77,33.25 46.77,33 LED_C12.A | 23.07,37.05 22.43,36.42 22.43,35.53 22.05,35.15 20.91,35.15 19.27,36.8 16.86,36.8 15.46,35.41 15.46,35.28 13.31,33.12 LED_C9.A
  Route15 0.127: v34.73,12.17 28.9,18 28.9,18.25 28.39,18.76 16.22,18.76 15.34,17.87 SV1.3 | v34.73,33.76 28.9,39.59 28.9,39.84 28.39,40.35 16.22,40.35 15.34,39.46 SV5.3
  Bottom 0.127: v7.99,22.43 7.99,27.76 5.96,29.79 5.96,32.83 7.99,34.85 16.22,34.85 16.48,35.11 16.48,38.15 15.34,39.29 SV5.3
SEG_D  (via drill 0.2)
  Top 0.127: v17.11,13.44 17.11,11.15 14.96,9 13.31,9 LED_D1.A | v20.15,10.65 20.28,10.77 22.18,10.77 22.31,10.65 22.31,9.89 23.19,9 24.34,9 LED_D2.A | v33.46,9.51 33.97,9 35.49,9 LED_D3.A | v45.63,9 46.64,9 LED_D4.A | v17.11,35.02 17.11,32.74 14.96,30.59 13.31,30.59 LED_D9.A | v20.15,32.24 20.28,32.36 22.18,32.36 22.31,32.24 22.31,31.48 23.19,30.59 24.34,30.59 LED_D10.A | v33.46,31.1 33.97,30.59 35.49,30.59 LED_D11.A | v45.63,30.59 46.64,30.59 LED_D12.A
  Route2 0.127: v45.63,9 33.97,9 v33.46,9.51 | v45.63,30.59 33.97,30.59 v33.46,31.1
  Route15 0.127: v33.46,9.51 31.18,9.51 30.04,10.65 v20.15,10.65 | v33.46,31.1 31.18,31.1 30.04,32.24 v20.15,32.24
  Bottom 0.127: 17.11,13.69 17.11,15.46 17.62,15.97 17.62,17.62 SV1.4 | 17.11,13.69 v17.11,13.44 | 17.11,13.69 v20.15,10.65 | 17.11,35.28 17.11,37.05 17.62,37.56 17.62,39.21 SV5.4 | 17.11,35.28 v17.11,35.02 | 17.11,35.28 v20.15,32.24 | v45.63,9 45.63,15.72 48.67,18.76 48.67,27.5 45.63,30.55 v45.63,30.59
SEG_E  (via drill 0.2)
  Top 0.127: v9.38,5.96 9.51,6.08 10.39,6.08 LED_E1.A | v14.45,6.08 15.46,5.07 19.14,5.07 20.15,6.08 21.55,6.08 LED_E2.A | v29.41,6.72 30.67,6.72 31.18,6.21 32.7,6.21 LED_E3.A | v41.45,6.84 42.08,6.84 42.71,6.21 43.85,6.21 LED_E4.A | v9.38,27.55 9.51,27.67 10.39,27.67 LED_E9.A | v14.45,27.67 15.46,26.66 19.14,26.66 20.15,27.67 21.55,27.67 LED_E10.A | v29.41,28.31 30.67,28.31 31.18,27.8 32.7,27.8 LED_E11.A | v41.45,28.43 42.08,28.43 42.71,27.8 43.85,27.8 LED_E12.A
  Route15 0.127: v9.38,5.96 8.87,6.46 8.87,7.73 17.87,16.73 19.27,16.73 20.28,17.74 SV1.5 | v29.41,6.72 15.08,6.72 v14.45,6.08 | v9.38,27.55 8.87,28.05 8.87,29.32 17.87,38.32 19.27,38.32 20.28,39.33 SV5.5 | v29.41,28.31 15.08,28.31 v14.45,27.67
  Bottom 0.127: v14.45,6.08 11.66,8.87 10.14,8.87 8.87,7.61 8.87,6.46 v9.38,5.96 | v41.45,6.84 41.32,6.72 v29.41,6.72 | v14.45,27.67 11.66,30.46 10.14,30.46 8.87,29.2 8.87,28.05 v9.38,27.55 | v41.45,28.43 41.32,28.31 v29.41,28.31 29.41,23.07 28.26,21.93 26.62,21.93 25.48,20.79 23.32,20.79 20.41,17.87 SV1.5
SEG_F  (via drill 0.2)
  Top 0.127: v9.38,6.59 9,6.21 7.99,6.21 LED_F1.A | v12.67,6.59 14.58,6.59 15.72,5.45 18,5.45 18.63,6.08 19.01,6.08 LED_F2.A | v25.98,7.73 28.26,5.45 29.15,5.45 29.79,6.08 30.16,6.08 LED_F3.A | 39.29,15.97 24.71,15.97 22.94,17.74 SV1.6 | 39.29,15.97 45.25,15.97 47.78,13.44 47.78,7.35 45.88,5.45 43.09,5.45 42.46,6.08 41.45,6.08 LED_F4.A | v9.38,28.18 9,27.8 7.99,27.8 LED_F9.A | v12.67,28.18 14.58,28.18 15.72,27.04 18,27.04 18.63,27.67 19.01,27.67 LED_F10.A | v25.98,29.32 28.26,27.04 29.15,27.04 29.79,27.67 30.16,27.67 LED_F11.A | SV5.6 22.94,39.33 24.71,37.56 45.25,37.56 47.78,35.02 47.78,28.94 45.88,27.04 43.09,27.04 42.46,27.67 41.45,27.67 LED_F12.A 41.45,27.63 39.29,25.48 39.29,15.97
  Route2 0.127: v9.38,6.59 v12.67,6.59 | v9.38,28.18 v12.67,28.18
  Route15 0.127: v9.38,6.59 9.38,7.86 17.87,16.35 21.42,16.35 22.81,17.74 SV1.6 | v9.38,28.18 9.38,29.45 17.87,37.94 21.42,37.94 22.81,39.33 SV5.6
  Bottom 0.127: v25.98,7.73 25.98,12.93 23.07,15.84 23.07,17.62 22.94,17.74 SV1.6 | v25.98,29.32 25.98,34.52 23.07,37.43 23.07,39.21 22.94,39.33 SV5.6
SEG_G  (via drill 0.2)
  Top 0.127: v6.84,9 5.2,9 LED_G1.A | v12.42,8.74 12.42,8.49 12.67,8.24 15.59,8.24 16.22,8.87 LED_G2.A | v26.24,13.69 26.24,11.41 27.38,10.27 27.38,9 LED_G3.A | v37.14,9.51 37.64,9 38.53,9 LED_G4.A | v6.84,30.59 5.2,30.59 LED_G9.A | v12.42,30.34 12.42,30.08 12.67,29.83 15.59,29.83 16.22,30.46 LED_G10.A | v26.24,35.28 26.24,33 27.38,31.86 27.38,30.59 LED_G11.A | v37.14,31.1 37.64,30.59 38.53,30.59 LED_G12.A
  Route2 0.127: v6.84,9 6.84,9.89 5.7,11.03 11.41,16.73 | 11.41,16.73 24.34,16.73 25.35,17.74 SV1.7 | SV5.7 25.35,39.33 24.34,38.32 11.41,38.32 5.7,32.62 6.84,31.48 v6.84,30.59 6.84,29.41 11.41,24.84 11.41,16.73
  Bottom 0.127: v6.84,9 9.89,9 10.14,9.25 11.91,9.25 v12.42,8.74 | SV1.7 25.48,17.74 25.6,17.62 25.6,15.84 26.24,15.21 v26.24,13.69 28.64,11.28 35.36,11.28 v37.14,9.51 | v6.84,30.59 9.89,30.59 10.14,30.84 11.91,30.84 v12.42,30.34 | SV5.7 25.48,39.33 25.6,39.21 25.6,37.43 26.24,36.8 v26.24,35.28 28.64,32.87 35.36,32.87 v37.14,31.1
SEG_H  (via drill 0.2)
  Top 0.127: v27.25,14.96 26.74,14.45 26.74,12.42 27.38,11.79 27.38,11.41 LED_H3.A | v37.14,11.28 38.53,11.28 LED_H4.A | v6.84,11.53 5.2,11.53 LED_H1.A 5.07,11.53 v4.44,12.17 | v12.8,10.65 13.56,10.65 14.32,11.41 16.22,11.41 LED_H2.A | v27.25,36.55 26.74,36.04 26.74,34.01 27.38,33.38 27.38,33 LED_H11.A | v37.14,32.87 38.53,32.87 LED_H12.A | v6.84,33.12 5.2,33.12 LED_H9.A | v12.8,32.24 13.56,32.24 14.32,33 16.22,33 LED_H10.A
  Route2 0.127: v6.84,11.53 17.74,11.53 21.17,14.96 v27.25,14.96 | v6.84,33.12 17.74,33.12 21.17,36.55 v27.25,36.55
  Bottom 0.127: SV1.8 27.88,17.74 27.76,17.62 27.76,15.97 27.25,15.46 v27.25,14.96 30.55,11.66 36.76,11.66 v37.14,11.28 | v12.8,10.65 11.91,11.53 v6.84,11.53 | SV5.8 27.88,39.33 27.76,39.21 27.76,37.56 27.25,37.05 v27.25,36.55 30.55,33.25 36.76,33.25 v37.14,32.87 | v12.8,32.24 11.91,33.12 v6.84,33.12 6.84,33.08 6.34,32.57 6.34,29.79 8.49,27.63 8.49,17.87 7.99,17.36 7.35,17.36 4.44,14.45 v4.44,12.17
SEG_K  (via drill 0.2)
  Top 0.127: v10.14,12.29 8.87,12.29 8.24,11.66 7.86,11.66 LED_K1.A | v18.12,11.28 18.63,11.28 18.89,11.53 LED_K2.A | v30.93,14.96 30.93,13.81 30.16,13.05 30.16,11.66 LED_K3.A | v40.05,11.53 41.19,11.53 LED_K4.A | v10.14,33.88 8.87,33.88 8.24,33.25 7.86,33.25 LED_K9.A | v18.12,32.87 18.63,32.87 18.89,33.12 LED_K10.A | v30.93,36.55 30.93,35.41 30.16,34.65 30.16,33.25 LED_K11.A | v40.05,33.12 41.19,33.12 LED_K12.A
  Route2 0.127: v18.12,11.28 27.25,11.28 v30.93,14.96 | v18.12,32.87 27.25,32.87 v30.93,36.55
  Bottom 0.127: v10.14,12.29 17.11,12.29 v18.12,11.28 | 30.67,17.62 30.67,15.84 30.93,15.59 v30.93,14.96 30.93,13.31 32.19,12.04 32.45,12.04 33.08,12.67 38.91,12.67 v40.05,11.53 | 30.67,17.62 30.55,17.74 SV1.9 30.67,17.62 | v10.14,33.88 17.11,33.88 v18.12,32.87 | SV5.9 30.55,39.33 30.67,39.21 30.67,37.43 30.93,37.18 v30.93,36.55 30.93,34.9 32.19,33.63 32.45,33.63 33.08,34.26 38.91,34.26 v40.05,33.12 40.05,33.21 41.45,34.6 41.95,34.6 42.71,33.84 42.71,24.71 38.78,20.79 33.84,20.79 30.67,17.62
SEG_M  (via drill 0.2)
  Top 0.127: v9.89,11.03 9.51,11.41 9.25,11.41 LED_M1.A | v18.38,10.77 19.64,10.77 20.28,11.41 LED_M2.A | v32.32,12.55 31.56,11.79 31.56,11.53 LED_M3.A | v38.28,13.56 40.18,13.56 42.21,11.53 42.59,11.53 LED_M4.A | v9.89,32.62 9.51,33 9.25,33 LED_M9.A | v18.38,32.36 19.64,32.36 20.28,33 LED_M10.A | v32.32,34.14 31.56,33.38 31.56,33.12 LED_M11.A | v38.28,35.15 40.18,35.15 42.21,33.12 42.59,33.12 LED_M12.A
  Route2 0.127: v9.89,11.03 12.55,11.03 12.67,11.15 17.62,11.15 18,10.77 v18.38,10.77 | v9.89,32.62 12.55,32.62 12.67,32.74 17.62,32.74 18,32.36 v18.38,32.36
  Route15 0.127: v18.38,10.77 19.64,10.77 21.42,12.55 v32.32,12.55 | v18.38,32.36 19.64,32.36 21.42,34.14 v32.32,34.14
  Bottom 0.127: 32.32,13.56 32.32,15.34 32.83,15.84 32.83,17.62 32.95,17.74 SV1.10 33.08,17.87 33.46,17.87 35.99,20.41 38.78,20.41 43.09,24.71 43.09,33.84 41.83,35.11 38.28,35.11 v38.28,35.15 32.32,35.15 | 32.32,13.56 v32.32,12.55 | 32.32,13.56 v38.28,13.56 | 32.32,35.15 32.32,36.93 32.83,37.43 32.83,39.21 32.95,39.33 SV5.10 | 32.32,35.15 v32.32,34.14
SEG_N  (via drill 0.2)
  Top 0.127: v11.15,8.37 11.28,8.49 11.28,10.39 10.52,11.15 LED_N1.A | v19.52,12.04 20.91,12.04 21.29,11.66 21.67,11.66 LED_N2.A | v31.81,10.27 32.83,11.28 32.83,11.53 LED_N3.A | v41.83,12.55 42.08,12.29 42.97,12.29 43.6,11.66 43.98,11.66 LED_N4.A | v11.15,29.95 11.28,30.08 11.28,31.98 10.52,32.74 LED_N9.A | v19.52,33.63 20.91,33.63 21.29,33.25 21.67,33.25 LED_N10.A | v31.81,31.86 32.83,32.87 32.83,33.12 LED_N11.A | 43.37,33.48 42.97,33.88 42.08,33.88 v41.83,34.14 | 43.37,33.48 43.6,33.25 43.98,33.25 LED_N12.A | 43.37,33.48 v43.6,33.71 | 43.35,33.46 43.37,33.48
  Route15 0.127: v11.15,8.37 14.83,12.04 v19.52,12.04 20.53,13.05 32.45,13.05 32.83,12.67 32.83,12.42 31.81,11.41 v31.81,10.27 | v11.15,29.95 14.83,33.63 v19.52,33.63 20.53,34.65 32.45,34.65 32.83,34.26 32.83,34.01 31.81,33 v31.81,31.86
  Bottom 0.127: v11.15,8.37 11.03,8.49 10.14,8.49 9.63,7.99 9.63,6.97 9.89,6.72 9.89,4.31 10.14,4.06 10.14,2.66 SV2.1 | v31.81,10.27 33.08,9 38.28,9 v41.83,12.55 41.83,14.07 40.3,15.59 40.3,21.17 44.11,24.97 44.11,32.19 43.6,32.7 v43.6,33.71 | v11.15,29.95 11.03,30.08 10.14,30.08 9.63,29.57 9.63,28.56 9.89,28.31 9.89,25.9 10.14,25.65 10.14,24.25 SV6.1 | v41.83,34.14 38.28,30.59 33.08,30.59 v31.81,31.86
SEG_P  (via drill 0.2)
  Top 0.127: v10.14,7.86 9.76,8.24 9.76,8.87 10.39,9.51 10.39,10.14 LED_P1.A | v19.39,9.38 20.15,10.14 21.55,10.14 LED_P2.A | v33.46,10.77 33.33,10.77 32.83,10.27 LED_P3.A | v44.49,10.9 44.49,10.77 43.98,10.27 LED_P4.A | v10.14,29.45 9.76,29.83 9.76,30.46 10.39,31.1 10.39,31.73 LED_P9.A | v19.39,30.97 20.15,31.73 21.55,31.73 LED_P10.A | v33.46,32.36 33.33,32.36 32.83,31.86 LED_P11.A | v44.49,32.49 44.49,32.36 43.98,31.86 LED_P12.A
  Route2 0.127: v10.14,7.86 10.14,7.99 11.53,9.38 v19.39,9.38 19.52,9.38 20.91,10.77 v33.46,10.77 43.6,10.77 43.73,10.9 v44.49,10.9 | v10.14,29.45 10.14,29.57 11.53,30.97 v19.39,30.97 19.52,30.97 20.91,32.36 v33.46,32.36 43.6,32.36 43.73,32.49 v44.49,32.49
  Bottom 0.127: v10.14,7.86 10.14,6.84 11.79,5.2 11.79,4.44 12.67,3.55 12.67,2.66 SV2.2 | v10.14,29.45 10.14,28.43 11.79,26.79 11.79,26.03 12.67,25.14 12.67,24.25 SV6.2 | v44.49,10.9 44.49,14.96 40.69,18.76 40.69,21.17 44.49,24.97 v44.49,32.49
SEG_R  (via drill 0.2)
  Top 0.127: v10.77,7.99 10.52,8.24 10.52,8.74 LED_R1.A | v20.91,7.99 21.67,8.74 LED_R2.A | v30.67,9.38 30.8,9.51 31.94,9.51 32.57,8.87 32.83,8.87 LED_R3.A | v42.21,8.11 43.09,8.11 43.73,8.74 43.98,8.74 LED_R4.A | v10.77,29.57 10.52,29.83 10.52,30.34 LED_R9.A | v20.91,29.57 21.67,30.34 LED_R10.A | v30.67,30.97 30.8,31.1 31.94,31.1 32.57,30.46 32.83,30.46 LED_R11.A | v42.21,29.7 43.09,29.7 43.73,30.34 43.98,30.34 LED_R12.A
  Route2 0.127: v20.91,7.99 15.59,2.66 15.34,2.66 SV2.3 | v20.91,29.57 15.59,24.25 15.34,24.25 SV6.3
  Route15 0.127: v42.21,8.11 41.57,8.11 40.69,9 31.05,9 v30.67,9.38 | v42.21,29.7 41.57,29.7 40.69,30.59 31.05,30.59 v30.67,30.97
  Bottom 0.127: v10.77,7.99 10.77,7.61 15.21,3.17 15.21,2.66 SV2.3 | v30.67,9.38 30.29,9.76 28.64,9.76 | 28.64,9.76 26.11,7.22 21.67,7.22 v20.91,7.99 | v10.77,29.57 10.77,29.2 15.21,24.76 15.21,24.25 SV6.3 | v30.67,30.97 30.29,31.35 28.64,31.35 26.11,28.81 21.67,28.81 v20.91,29.57 | 28.64,9.76 28.64,10.65 24.34,14.96 24.34,18.89 26.62,21.17 34.73,21.17 37.14,23.57 37.14,25.35 39.42,27.63 41.7,27.63 42.33,28.26 42.33,29.53 42.21,29.66 v42.21,29.7
SEG_S  (via drill 0.2)
  Top 0.127: v20.28,7.99 20.28,8.74 LED_S2.A | v22.43,5.45 20.66,5.45 17.87,2.66 SV2.4 | v23.95,5.96 24.84,5.07 32.83,5.07 33.46,5.7 33.46,6.59 32.7,7.35 31.56,7.35 LED_S3.A | v36.38,5.45 40.43,5.45 40.56,5.58 40.56,6.59 41.32,7.35 42.59,7.35 LED_S4.A | v8.62,8.11 9.13,8.62 9.13,8.87 LED_S1.A | v20.28,29.57 20.28,30.34 LED_S10.A | v22.43,27.04 20.66,27.04 17.87,24.25 SV6.4 | v23.95,27.55 24.84,26.66 32.83,26.66 33.46,27.29 33.46,28.18 32.7,28.94 31.56,28.94 LED_S11.A | v36.38,27.04 40.43,27.04 40.56,27.17 40.56,28.18 41.32,28.94 42.59,28.94 LED_S12.A | v8.62,29.7 9.13,30.21 9.13,30.46 LED_S9.A
  Route2 0.127: v36.38,5.45 24.46,5.45 v23.95,5.96 | v8.62,8.11 9.25,8.11 10.14,7.22 19.52,7.22 v20.28,7.99 | v36.38,27.04 24.46,27.04 v23.95,27.55 | v8.62,29.7 9.25,29.7 10.14,28.81 19.52,28.81 v20.28,29.57
  Bottom 0.127: v20.28,7.99 20.28,7.61 v22.43,5.45 23.45,5.45 v23.95,5.96 | v20.28,29.57 20.28,29.2 v22.43,27.04 23.45,27.04 v23.95,27.55 | v8.62,8.11 7.1,8.11 5.07,10.14 5.07,14.7 7.35,16.98 7.99,16.98 8.87,17.87 8.87,27.63 8.49,28.01 8.49,29.53 8.62,29.66 v8.62,29.7
SEG_T  (via drill 0.2)
  Top 0.127: v9.63,9.63 8.62,9.63 7.86,8.87 LED_T1.A | v18.89,7.73 18.89,8.74 LED_T2.A | v22.43,8.49 22.94,8.49 23.19,8.24 27.88,8.24 28.39,8.74 30.04,8.74 LED_T3.A | v40.56,8.49 40.81,8.74 41.19,8.74 LED_T4.A | v9.63,31.22 8.62,31.22 7.86,30.46 LED_T9.A | v18.89,29.32 18.89,30.34 LED_T10.A | v22.43,30.08 22.94,30.08 23.19,29.83 27.88,29.83 28.39,30.34 30.04,30.34 LED_T11.A | v40.56,30.08 40.81,30.34 41.19,30.34 LED_T12.A
  Route2 0.127: v18.89,7.73 19.64,8.49 v22.43,8.49 v40.56,8.49 | v18.89,29.32 19.64,30.08 v22.43,30.08 v40.56,30.08
  Bottom 0.127: v9.63,9.63 13.69,9.63 17.24,6.08 | 17.24,6.08 20.28,3.04 20.28,2.66 SV2.5 | 17.24,6.08 v18.89,7.73 | v9.63,31.22 13.69,31.22 17.24,27.67 | 17.24,27.67 20.28,24.63 20.28,24.25 SV6.5 | 17.24,27.67 v18.89,29.32 | v22.43,8.49 22.43,16.1 21.8,16.73 21.8,18.89 23.32,20.41 25.48,20.41 26.62,21.55 30.04,21.55 32.07,23.57 32.07,25.35 34.73,28.01 41.7,28.01 41.95,28.26 41.95,28.64 40.56,30.04 v40.56,30.08
SEG_U  (via drill 0.2)
  Top 0.127: v9.63,10.27 7.99,10.27 LED_U1.A | v18,8.87 19.01,9.89 19.01,10.14 LED_U2.A | v29.02,9.25 29.91,10.14 30.16,10.14 LED_U3.A | v40.56,9.51 40.69,9.51 41.32,10.14 LED_U4.A | v9.63,31.86 7.99,31.86 LED_U9.A | v18,30.46 19.01,31.48 19.01,31.73 LED_U10.A | v29.02,30.84 29.91,31.73 30.16,31.73 LED_U11.A | v40.56,31.1 40.69,31.1 41.32,31.73 LED_U12.A
  Bottom 0.127: v9.63,10.27 12.55,10.27 12.8,10.01 17.24,10.01 18.12,9.13 | 19.01,8.24 21.93,5.32 21.93,4.56 22.31,4.18 22.31,4.06 22.81,3.55 | 19.01,8.24 18.12,9.13 | 22.81,3.55 22.81,2.66 SV2.6 22.81,3.55 | v18,8.87 18,9 18.12,9.13 | 22.81,3.55 23.32,3.55 v29.02,9.25 29.66,8.62 39.67,8.62 v40.56,9.51 | v9.63,31.86 12.55,31.86 12.8,31.6 17.24,31.6 18.12,30.72 | 18.12,30.72 21.93,26.91 21.93,26.15 22.31,25.77 22.31,25.65 22.81,25.14 | 22.81,25.14 22.81,24.25 SV6.6 22.81,25.14 | v18,30.46 18,30.59 18.12,30.72 | 26.21,28.03 23.32,25.14 22.81,25.14 | 26.21,28.03 v29.02,30.84 29.66,30.21 39.67,30.21 v40.56,31.1 | 19.01,8.24 20.66,9.89 20.66,15.21 19.27,16.6 19.27,18.89 21.55,21.17 25.48,21.17 26.62,22.31 28.26,22.31 28.9,22.94 28.9,25.35 26.21,28.03

### Text on the board
Top: (C) N LARMOUR 2021 | ODU DISPLAY V1 | COMMON / CATHODE | (C) N LARMOUR 2021 | ODU DISPLAY V1 | COMMON / CATHODE
Bottom: (C) N LARMOUR 2021 | ODU DISPLAY V1 | COMMON / CATHODE | (C) N LARMOUR 2021 | ODU DISPLAY V1 | COMMON / CATHODE
tDocu: A | A | B | C | D | E | F | G | H | K | M | GND | N | P | R | S | T | U | K0 | K1 | K2 | K3 | K4 | K5 | ODU DISPLAY V1 / (C) NEIL LARMOUR / 2021 | A | A | B | C | D | E | F | G | H | K | M | GND | N | P | R | S | T | U | K0 | K1 | K2 | K3 | K4 | K5 | ODU DISPLAY V1 / (C) NEIL LARMOUR / 2021
bDocu: A | B | C | D | E | F | G | H | K | M | N | P | R | S | T | U | K0 | K1 | K2 | K3 | K4 | K5 | ODU DISPLAY V1 / (C) NEIL LARMOUR / 2021 | A | B | C | D | E | F | G | H | K | M | N | P | R | S | T | U | K0 | K1 | K2 | K3 | K4 | K5 | ODU DISPLAY V1 / (C) NEIL LARMOUR / 2021